# Altium schematic sheet Э3.SchDoc: плата
size 420 x 297 mm; DrawnBy: Каверзнев; DocumentNumber: Э3; SheetNumber: 1; SheetTotal: 1; Title1str: Ремонт Труб; DocumentType: схема электрическая принципиальная; Format: A3; ImagePath: Введите номер платы
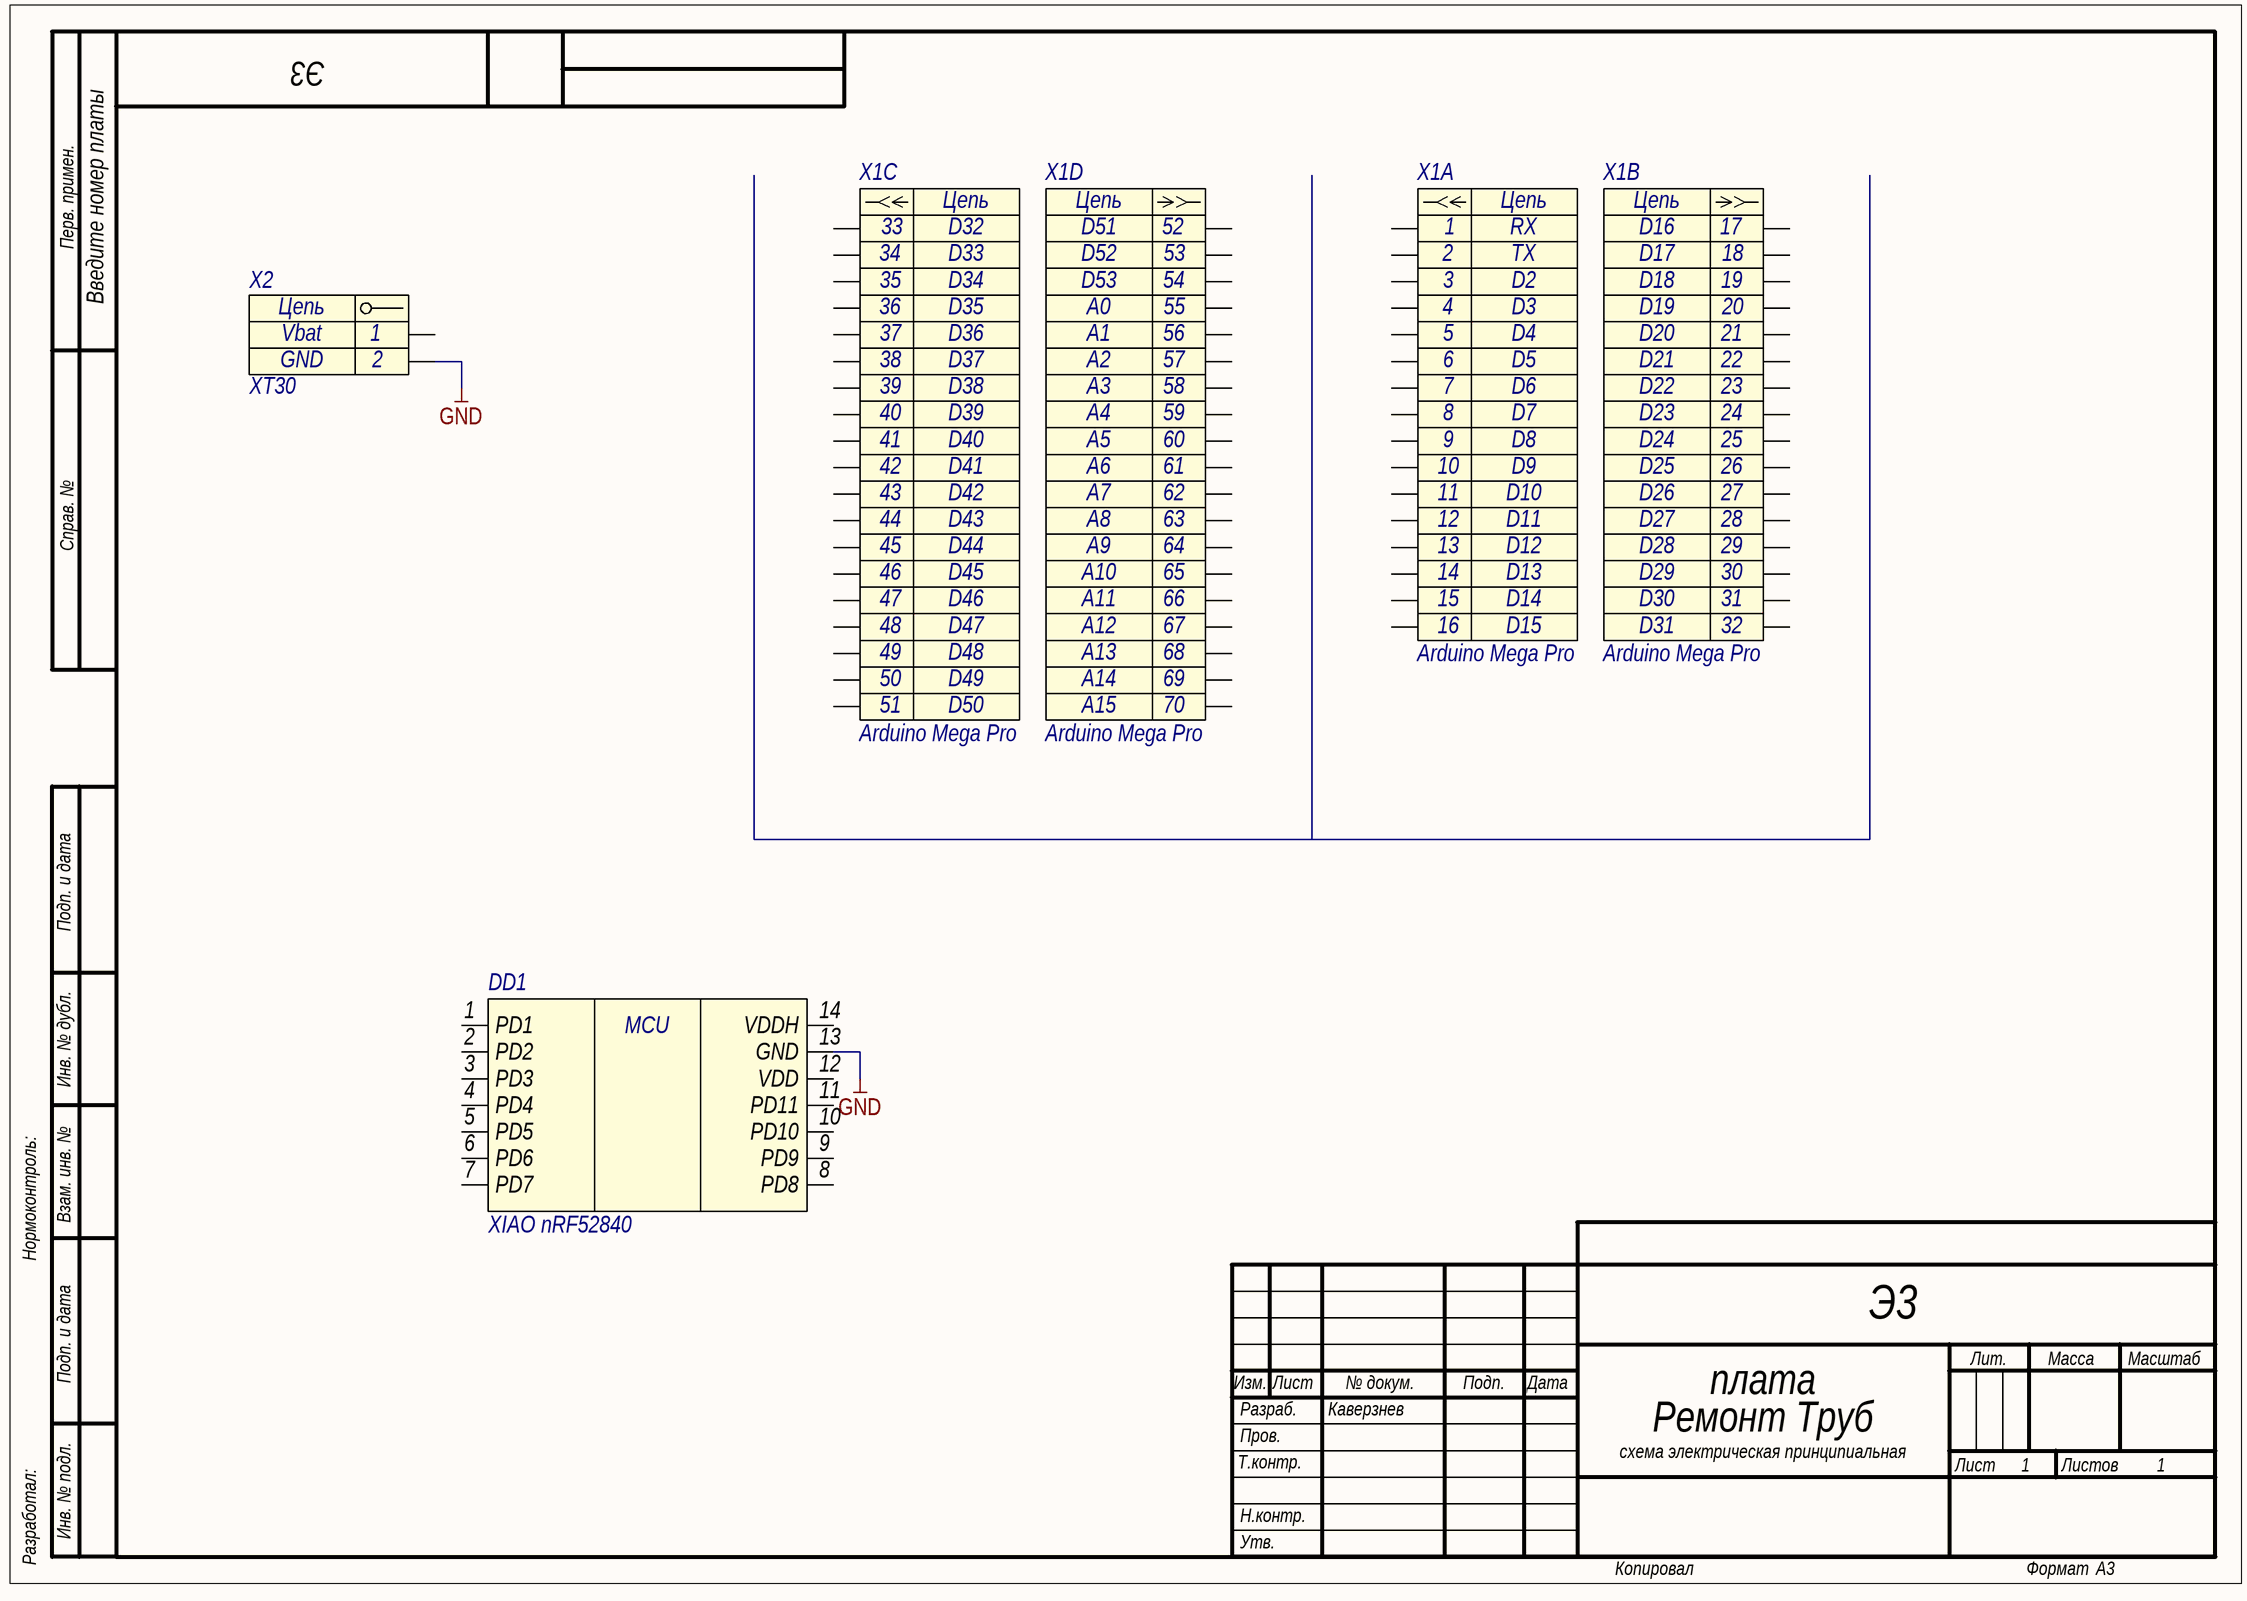
[diagram p0: Э3.SchDoc]

## Parts
DD1  XIAO nRF52840  [Seeed Studio XIAO nRF52840]
X1  Arduino Mega Pro  [Arduino Mega Pro]  (parts A,B,C,D of 4)
X2  XT30  [XT30]

## Nets
GND: DD1.13(GND) X2.2

Not connected (* = marked no-connect by the designer): DD1 1(PD1) 2(PD2) 3(PD3) 4(PD4) 5(PD5) 6(PD6) 7(PD7) 8(PD8) 9(PD9) 10(PD10) 11(PD11) 12(VDD) 14(VDDH); X1 1 2 3 4 5 6 7 8 9 10 11 12 13 14 15 16 17 18 19 20 21 22 23 24 25 26 27 28 29 30 31 32 33 34 35 36 37 38 39 40 41 42 43 44 45 46 47 48 49 50 51 52 53 54 55 56 57 58 59 60 61 62 63 64 65 66 67 68 69 70; X2 1

## Notes on the sheet
- Перв. примен.
- Справ. №
- Подп. и дата
- Инв. № дубл.
- Нормоконтроль:
- Взам. инв. №
- Изм.
- Лист
- № докум.
- Подп.
- Дата
- Лит.
- Масса
- Масштаб
- Т.контр.
- Пров.
- Разраб.
- Листов
- Разработал:
- Инв. № подл.
- Н.контр.
- Утв.
- Копировал
- Формат
- (in symbol Arduino Mega Pro Mini, part A) Цепь; RX; TX; D2; D3; D4; D5; D6; D7; D8; D9; D10; D11; D12; D13; D14; D15
- (in symbol Arduino Mega Pro Mini, part B) Цепь; D16; D17; D18; D19; D20; D21; D22; D23; D24; D25; D26; D27; D28; D29; D30; D31; /
- (in symbol Arduino Mega Pro Mini, part C) Цепь; D32; D33; D34; D35; D36; D37; D38; D39; D40; D41; D42; D43; D44; D45; D46; D47; D48; D49; D50
- (in symbol Arduino Mega Pro Mini, part D) Цепь; D51; D52; D53; A0; A1; A2; A3; A4; A5; A6; A7; A8; A9; A10; A11; A12; A13; A14; A15
- (in symbol XIAO nRF52840) MCU
- (in symbol XT30) Цепь

## Library data of the parts
DD1 = XIAO nRF52840: Микроконтроллер nRF52840; Name: XIAO nRF52840; HelpURL: https://wiki.seeedstudio.com/XIAO_BLE/#hardware-overview
X1 = Arduino Mega Pro Mini: Name: Arduino Mega Pro
X2 = XT30: Contact_1: Vbat; Contact_2: GND; Name: XT30